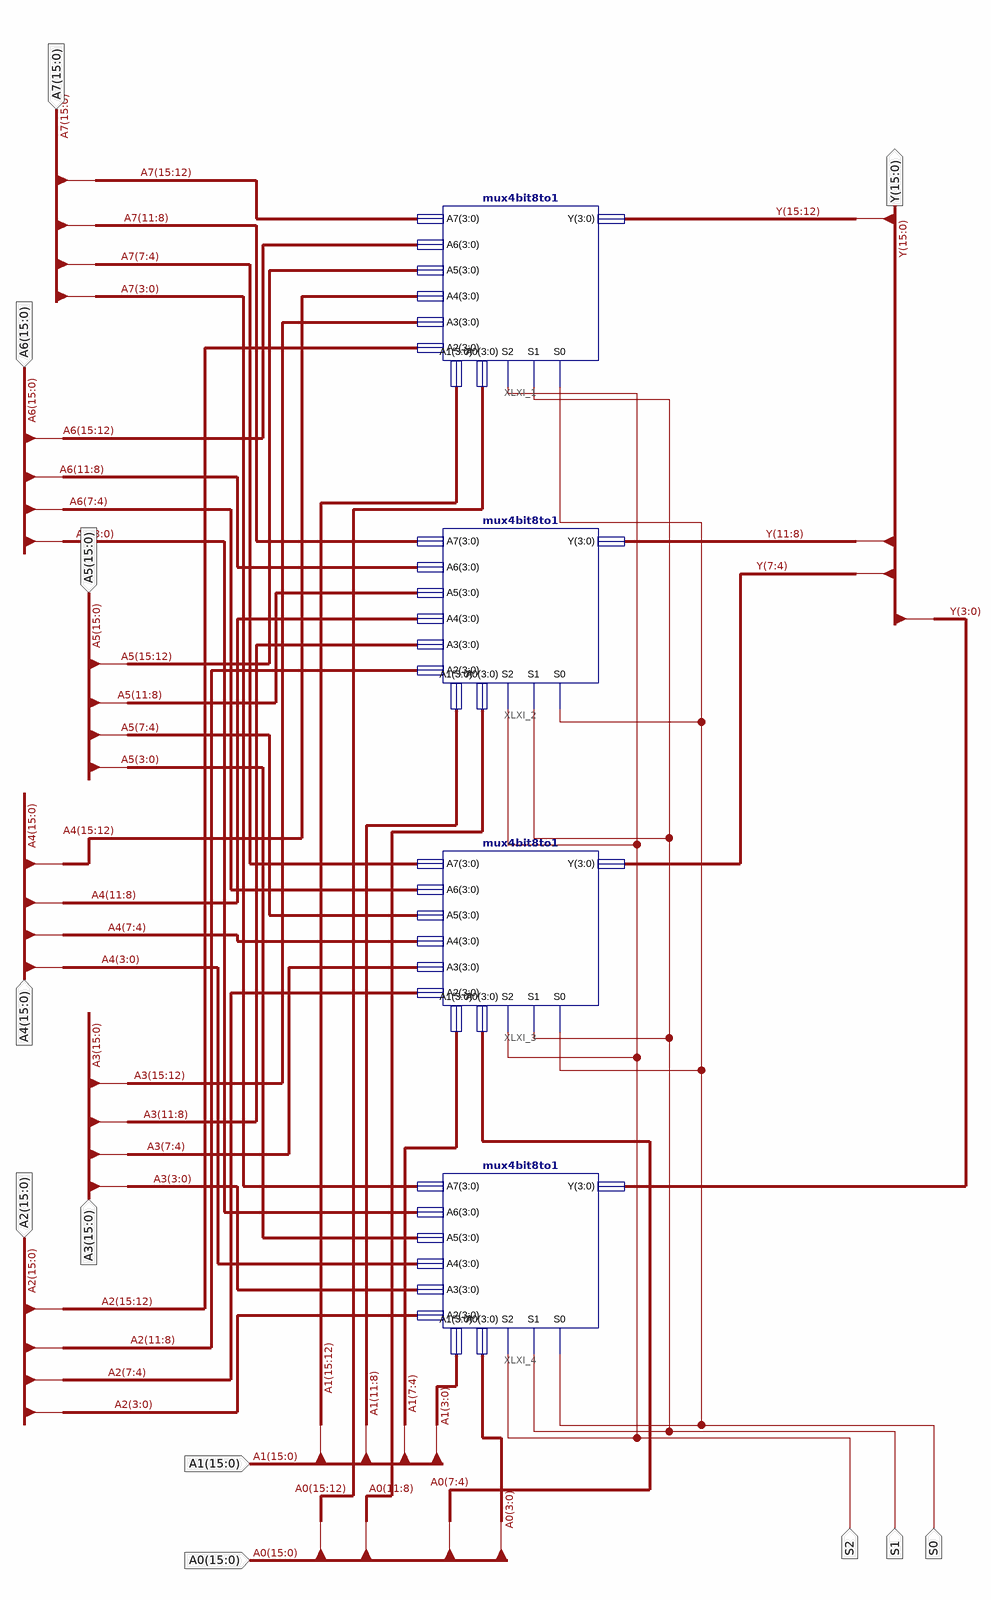
[diagram p0: schematic sheet 1]
// Xilinx ISE schematic mux4X4bit8to1.sch (spartan3e) as structural Verilog: 4 symbols, 12 ports
module mux4X4bit8to1 (
  input  [15:0] A7,
  input  [15:0] A6,
  input  [15:0] A5,
  input  [15:0] A4,
  input  [15:0] A3,
  input  [15:0] A2,
  input  [15:0] A1,
  input  [15:0] A0,
  input  S2,
  input  S1,
  input  S0,
  output [15:0] Y
);

  mux4bit8to1 XLXI_1 (
    .A7(A7[15:12]), .A6(A6[15:12]), .A5(A5[15:12]), .A4(A4[15:12]), .A3(A3[15:12]), .A2(A2[15:12]),
    .Y(Y[15:12]), .S1(S1), .S0(S0), .A1(A1[15:12]), .A0(A0[15:12]), .S2(S2));
  mux4bit8to1 XLXI_2 (
    .A7(A7[11:8]), .A6(A6[11:8]), .A5(A5[11:8]), .A4(A4[11:8]), .A3(A3[11:8]), .A2(A2[11:8]), .Y(Y[11:8]),
    .S1(S1), .S0(S0), .A1(A1[11:8]), .A0(A0[11:8]), .S2(S2));
  mux4bit8to1 XLXI_3 (
    .A7(A7[7:4]), .A6(A6[7:4]), .A5(A5[7:4]), .A4(A4[7:4]), .A3(A3[7:4]), .A2(A2[7:4]), .Y(Y[7:4]), .S1(S1),
    .S0(S0), .A1(A1[7:4]), .A0(A0[7:4]), .S2(S2));
  mux4bit8to1 XLXI_4 (
    .A7(A7[3:0]), .A6(A6[3:0]), .A5(A5[3:0]), .A4(A4[3:0]), .A3(A3[3:0]), .A2(A2[3:0]), .Y(Y[3:0]), .S1(S1),
    .S0(S0), .A1(A1[3:0]), .A0(A0[3:0]), .S2(S2));
endmodule
